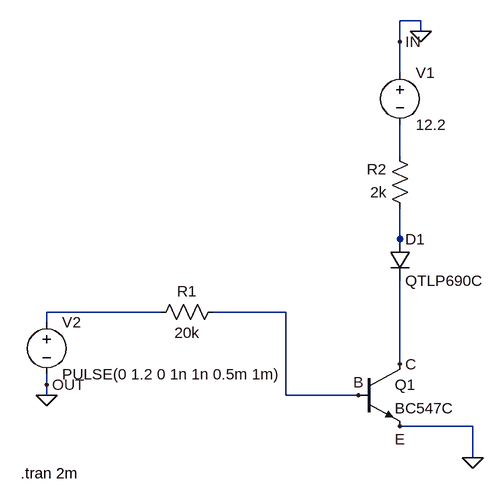
[diagram p0: schematic tranzystor_bjt.asc]
tranzystor_bjt.asc, the LTspice schematic file:
Version 4.1
SHEET 1 880 680
WIRE 464 -48 432 -48
WIRE 464 -32 464 -48
WIRE 432 -16 432 -48
WIRE 432 32 432 -16
WIRE 432 160 432 112
WIRE 432 288 432 240
WIRE 432 304 432 288
WIRE 64 400 -112 400
WIRE 256 400 144 400
WIRE -112 416 -112 400
WIRE 432 480 432 352
WIRE -112 512 -112 496
WIRE -112 528 -112 512
WIRE 256 528 256 400
WIRE 368 528 256 528
WIRE 544 576 432 576
WIRE 544 624 544 576
FLAG 464 -32 0
FLAG 544 624 0
FLAG -112 528 0
FLAG 432 -16 IN
FLAG -112 512 OUT
FLAG 368 528 B
FLAG 432 480 C
FLAG 432 576 E
SYMBOL npn 368 480 R0
SYMATTR InstName Q1
SYMATTR Value BC547C
SYMBOL diode 416 288 R0
SYMATTR InstName D1
SYMATTR Value QTLP690C
SYMATTR Description Diode
SYMATTR Type diode
SYMBOL voltage 432 16 R0
WINDOW 123 0 0 Left 0
WINDOW 39 0 0 Left 0
SYMATTR InstName V1
SYMATTR Value 12.2
SYMBOL res 160 384 R90
WINDOW 0 0 56 VBottom 2
WINDOW 3 32 56 VTop 2
SYMATTR InstName R1
SYMATTR Value 20k
SYMBOL res 448 256 R180
WINDOW 0 36 76 Left 2
WINDOW 3 36 40 Left 2
SYMATTR InstName R2
SYMATTR Value 2k
SYMBOL voltage -112 400 R0
WINDOW 123 0 0 Left 0
WINDOW 39 0 0 Left 0
SYMATTR InstName V2
SYMATTR Value PULSE(0 1.2 0 1n 1n 0.5m 1m)
TEXT -152 648 Left 2 !.tran 2m

The netlist it stands for:
* tranzystor_bjt.asc
Q1 C B 0 0 BC547C
D1 N002 C QTLP690C
V1 0 N001 12.2
R1 B N003 20k
R2 N002 N001 2k
V2 N003 0 PULSE(0 1.2 0 1n 1n 0.5m 1m)
.model D D
.lib standard.dio
.model NPN NPN
.model PNP PNP
.lib standard.bjt
.tran 2m
.backanno
.end